# Altium schematic sheet [11] - EXP CONN, uSD.SchDoc
size A2; DocumentNumber: 11; SheetNumber: 11; SheetTotal: 13; NameAuthor: Angle Vu
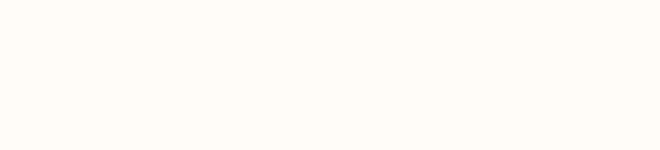
[diagram p0: [11] - EXP CONN, uSD.SchDoc]

## Notes on the sheet
- CLOCKS (CPU & PCIE)
- Designed By
- Checked By
- Page Name:
- Size:
- A2
- Company:
- Address:
- Sheet:
- /